# EAGLE design PowerBoard (EAGLE 5.07)
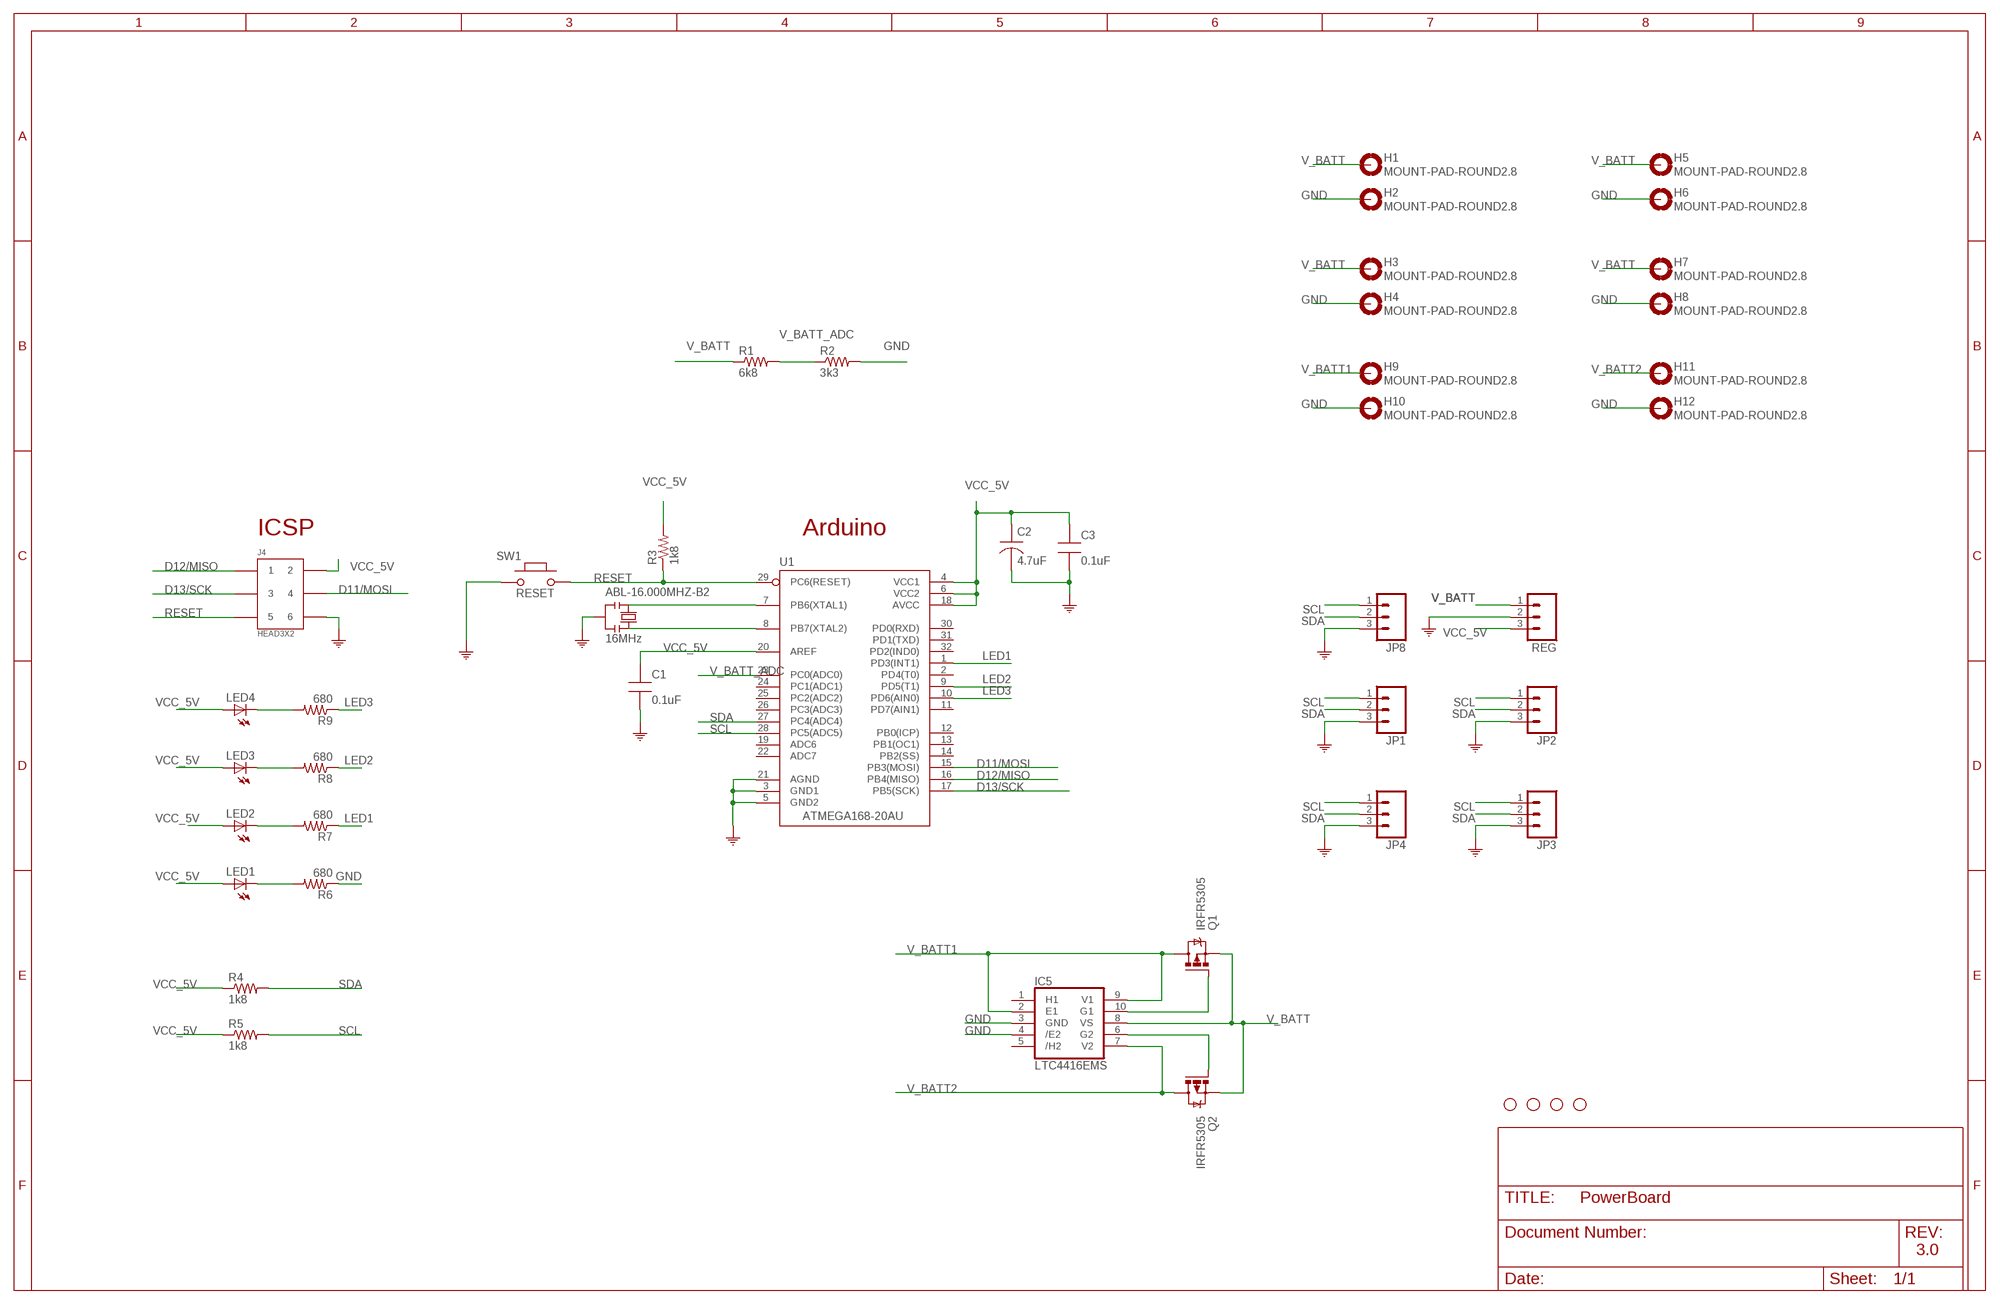
[diagram p0: schematic, sheet 1]

## Parts
ABL-16.000MHZ-B2  16MHz  RESONATORMU  [RESONATOR]
C1  0.1uF  CAP0805-NP  [CAP0805-NP]
C2  4.7uF  CAP-TANA-P  [TAN-A]
C3  0.1uF  CAP0805-NP  [CAP0805-NP]
H1  MOUNT-PAD-ROUND2.8  [2,8-PAD]
H2  MOUNT-PAD-ROUND2.8  [2,8-PAD]
H3  MOUNT-PAD-ROUND2.8  [2,8-PAD]
H4  MOUNT-PAD-ROUND2.8  [2,8-PAD]
H5  MOUNT-PAD-ROUND2.8  [2,8-PAD]
H6  MOUNT-PAD-ROUND2.8  [2,8-PAD]
H7  MOUNT-PAD-ROUND2.8  [2,8-PAD]
H8  MOUNT-PAD-ROUND2.8  [2,8-PAD]
H9  MOUNT-PAD-ROUND2.8  [2,8-PAD]
H10  MOUNT-PAD-ROUND2.8  [2,8-PAD]
H11  MOUNT-PAD-ROUND2.8  [2,8-PAD]
H12  MOUNT-PAD-ROUND2.8  [2,8-PAD]
IC5  LTC4416EMS  [MSOP10]
J4  HEAD3X2  [HEAD3X2]
JP1  M03PTH  [1X03]
JP2  M03PTH  [1X03]
JP3  M03PTH  [1X03]
JP4  M03PTH  [1X03]
JP8  M03PTH  [1X03]
JP12  STAND-OFF  [STAND-OFF]
JP13  STAND-OFF  [STAND-OFF]
JP14  STAND-OFF  [STAND-OFF]
JP15  STAND-OFF  [STAND-OFF]
LED1  LEDSMT1206  [1206]
LED2  LEDSMT1206  [1206]
LED3  LEDSMT1206  [1206]
LED4  LEDSMT1206  [1206]
Q1  IRFR5305  [D-PAK_TO252AA]
Q2  IRFR5305  [D-PAK_TO252AA]
R1  6k8  R-US_R0805  [R0805]
R2  3k3  R-US_R0805  [R0805]
R3  1k8  R-US_R0805  [R0805]
R4  1k8  R-US_R0805  [R0805]
R5  1k8  R-US_R0805  [R0805]
R6  680  R-US_R0805  [R0805]
R7  680  R-US_R0805  [R0805]
R8  680  R-US_R0805  [R0805]
R9  680  R-US_R0805  [R0805]
REG  M03PTH  [1X03]
SW1  RESET  PB157  [157SW]
U1  ATMEGA168-20AU  [QFP032]

## Nets
D11/MOSI: J4.4 U1.15(PB3(MOSI))
D12/MISO: J4.1 U1.16(PB4(MISO))
D13/SCK: J4.3 U1.17(PB5(SCK))
GND: ABL-16.000MHZ-B2.2 C1.2 C2.2 C3.2 H2.B2,8(MOUNT) H4.B2,8(MOUNT) H6.B2,8(MOUNT) H8.B2,8(MOUNT) H10.B2,8(MOUNT) H12.B2,8(MOUNT) IC5.3(GND) IC5.4(/E2) J4.6 JP1.3 JP2.3 JP3.3 JP4.3 JP8.3 R2.2 R6.1 REG.2 SW1.1 U1.3(GND1) U1.5(GND2) U1.21(AGND) ; supply symbol labelled COM
LED1: R7.1 U1.1(PD3(INT1))
LED2: R8.1 U1.9(PD5(T1))
LED3: R9.1 U1.10(PD6(AIN0))
N$1: ABL-16.000MHZ-B2.3 U1.8(PB7(XTAL2))
N$2: ABL-16.000MHZ-B2.1 U1.7(PB6(XTAL1))
N$3: LED1.C R6.2
N$4: LED2.C R7.2
N$5: LED3.C R8.2
N$6: LED4.C R9.2
N$7: IC5.10(G1) Q1.1(G)
N$8: IC5.6(G2) Q2.1(G)
RESET: J4.5 R3.1 SW1.2 U1.29(PC6(RESET))
SCL: JP1.1 JP2.1 JP3.1 JP4.1 JP8.1 R5.2 U1.28(PC5(ADC5))
SDA: JP1.2 JP2.2 JP3.2 JP4.2 JP8.2 R4.2 U1.27(PC4(ADC4))
V_BATT: H1.B2,8(MOUNT) H3.B2,8(MOUNT) H5.B2,8(MOUNT) H7.B2,8(MOUNT) IC5.8(VS) Q1.3(S) Q2.3(S) R1.1 REG.1
V_BATT1: H9.B2,8(MOUNT) IC5.2(E1) IC5.9(V1) Q1.4(D)
V_BATT2: H11.B2,8(MOUNT) IC5.7(V2) Q2.4(D)
V_BATT_ADC: R1.2 R2.1 U1.23(PC0(ADC0))
VCC_5V: C1.1 C2.1 C3.1 J4.2 LED1.A LED2.A LED3.A LED4.A R3.2 R4.1 R5.1 REG.3 U1.4(VCC1) U1.6(VCC2) U1.18(AVCC) U1.20(AREF)
Unconnected: IC5.1(H1) IC5.5(/H2) U1.2(PD4(T0)) U1.11(PD7(AIN1)) U1.12(PB0(ICP)) U1.13(PB1(OC1)) U1.14(PB2(SS)) U1.19(ADC6) U1.22(ADC7) U1.24(PC1(ADC1)) U1.25(PC2(ADC2)) U1.26(PC3(ADC3)) U1.30(PD0(RXD)) U1.31(PD1(TXD)) U1.32(PD2(IND0))

## Notes on the sheet
- ICSP | Arduino
- 3.0

## Library data of the parts
ABL-16.000MHZ-B2 = MySMD2:RESONATOR
C1 C3 = MySMD:CAP0805-NP
C2 = MySMD:CAP-TANA-P
H1-H12 = holes:MOUNT-PAD-ROUND: MOUNTING PAD, round
IC5 = linear-technology-3:LTC4416*: Low Loss Dual PowerPath Controllers
J4 = MyCON2:HEAD3X2
JP1-JP4 JP8 REG = SparkFun:M03: Header 3 Standard 3-pin 0.1" header. Use with straight break away headers (SKU : PRT-00116), right angle break away headers (PRT-00553), swiss pins (PRT-00743), machine pins (PRT-00117), and female headers (PRT-00115). Molex polarized connector foot print use with SKU : PRT-08232 with associated crimp pins and housings.
JP12-JP15 = SparkFun:STAND-OFF: Stand Off This is the mechanical footprint for a #4 phillips button head screw. Use the keepout ring to avoid running the screw head into surrounding components. SKU : PRT-00447
LED1-LED4 = led:LED: LED OSRAM: - CHIPLED LG R971, LG N971, LY N971, LG Q971, LY Q971, LO R971, LY R971 LH N974, LH R974 LS Q976, LO Q976, LY Q976 LO Q996 - Hyper CHIPLED LW Q18S LB Q993, LB Q99A, LB R99A - SideLED LS A670, LO A670, LY A670, LG A670, LP A670 LB A673, LV A673, LT A673, LW A673 LH A674 LY A675 LS A676, LA A676, LO A676, LY A676, LW A676 LS A679, LY A679, LG A679 - Hyper Micro SIDELED® LS Y876, LA Y876, LO Y876, LY Y876 LT Y87S - SmartLED LW L88C, LW L88S LB L89C, LB L89S, LG L890 LS L89K, LO L89K, LY L89K LS L896, LA L896, LO L896, LY L896 - TOPLED LS T670, LO T670, LY T670, LG T670, LP T670 LSG T670, LSP T670, LSY T670, LOP T670, LYG T670 LG T671, LOG T671, LSG T671 LB T673, LV T673, LT T673, LW T673 LH T674 LS T676, LA T676, LO T676, LY T676, LB T676, LH T676, LSB T676, LW T676 LB T67C, LV T67C, LT T67C, LS T67K, LO T67K, LY T67K, LW E67C LS E67B, LA E67B, LO E67B, LY E67B, LB E67C, LV E67C, LT E67C LW T67C LS T679, LY T679, LG T679 LS T770, LO T770, LY T770, LG T770, LP T770 LB T773, LV T773, LT T773, LW T773 LH T774 LS E675, LA E675, LY E675, LS T675 LS T776, LA T776, LO T776, LY T776, LB T776 LHGB T686 LT T68C, LB T68C - Hyper Mini TOPLED® LB M676 - Mini TOPLED Santana® LG M470 LS M47K, LO M47K, LY M47K Source: http://www.osram.convergy.de LUXEON: - LUMILED® LXK2-PW12-R00, LXK2-PW12-S00, LXK2-PW14-U00, LXK2-PW14-V00 LXK2-PM12-R00, LXK2-PM12-S00, LXK2-PM14-U00 LXK2-PE12-Q00, LXK2-PE12-R00, LXK2-PE12-S00, LXK2-PE14-T00, LXK2-PE14-U00 LXK2-PB12-K00, LXK2-PB12-L00, LXK2-PB12-M00, LXK2-PB14-N00, LXK2-PB14-P00, LXK2-PB14-Q00 LXK2-PR12-L00, LXK2-PR12-M00, LXK2-PR14-Q00, LXK2-PR14-R00 LXK2-PD12-Q00, LXK2-PD12-R00, LXK2-PD12-S00 LXK2-PH12-R00, LXK2-PH12-S00 LXK2-PL12-P00, LXK2-PL12-Q00, LXK2-PL12-R00 Source: www.luxeon.com KINGBRIGHT: KA-3528ASYC Source: www.kingbright.com
Q1 Q2 = transistor-power:IRF?5305: HEXFET Power MOSFET Source: http://www.irf.com/product-info/datasheets/data/irfr5305pbf.pdf
R1-R9 = resistor:R-US_: RESISTOR, American symbol
SW1 = MySMD:PB157
U1 = MySMD:ATMEGA168-20AU

## Board
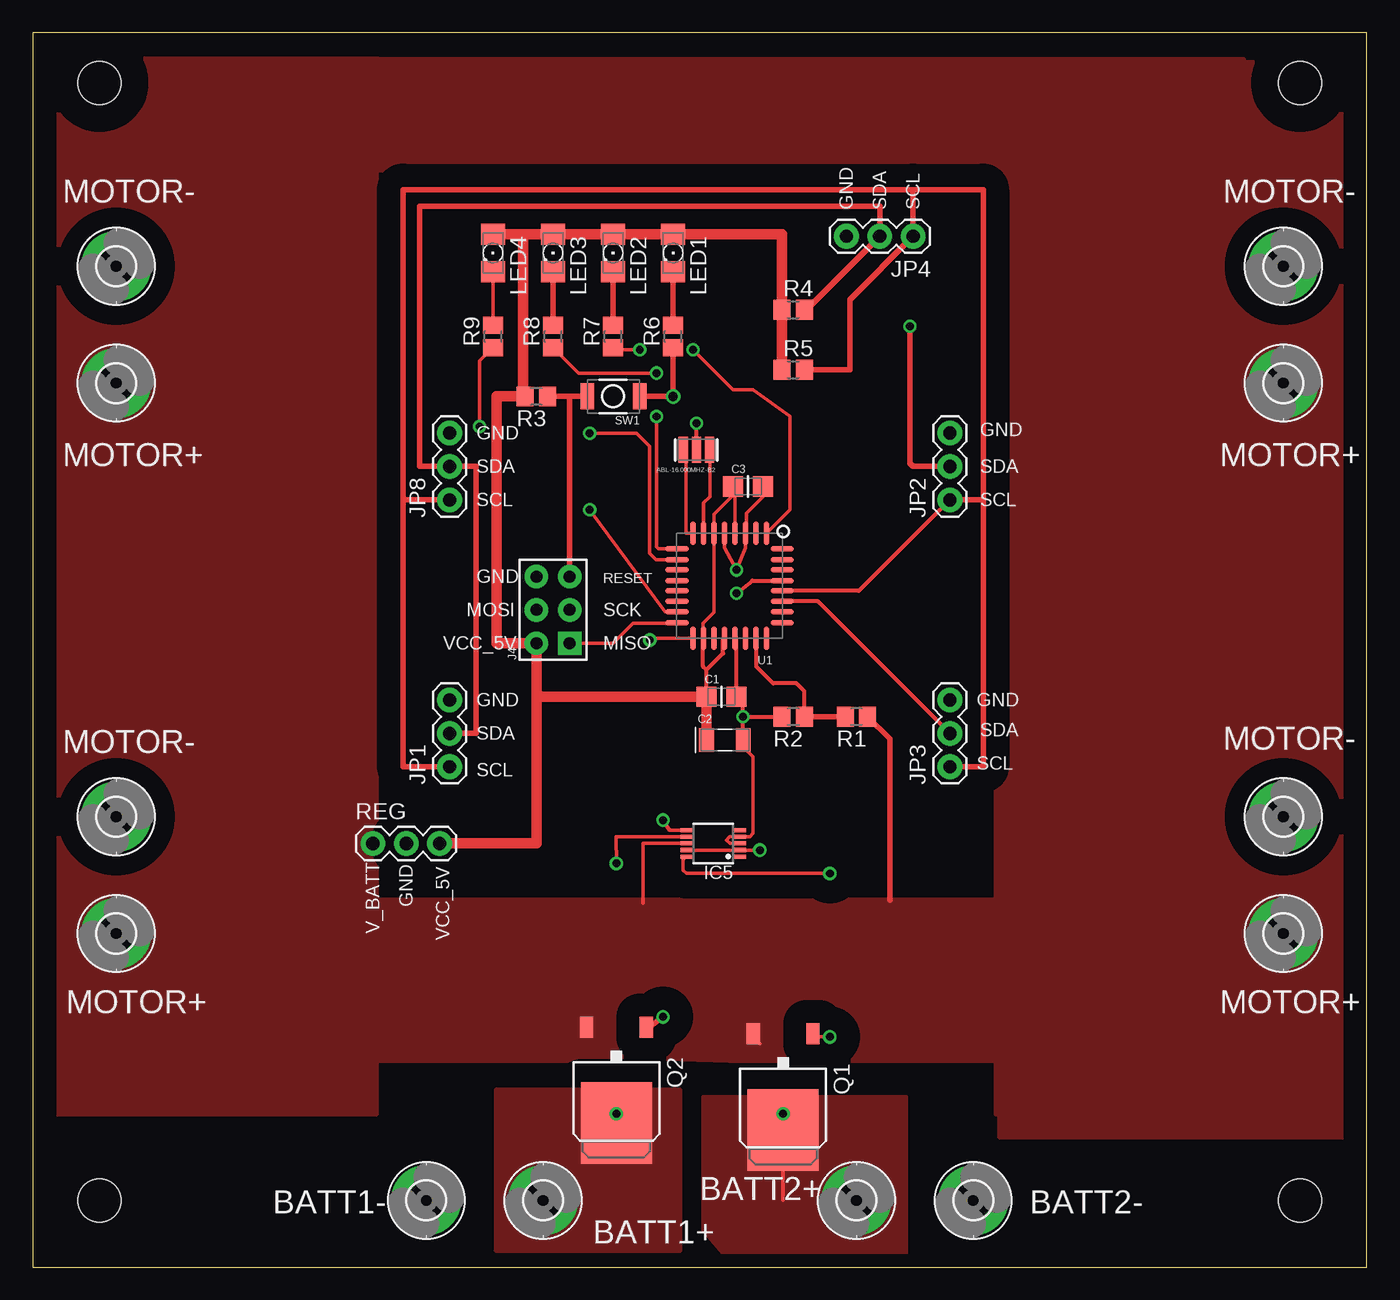
[diagram p1: board, top side]
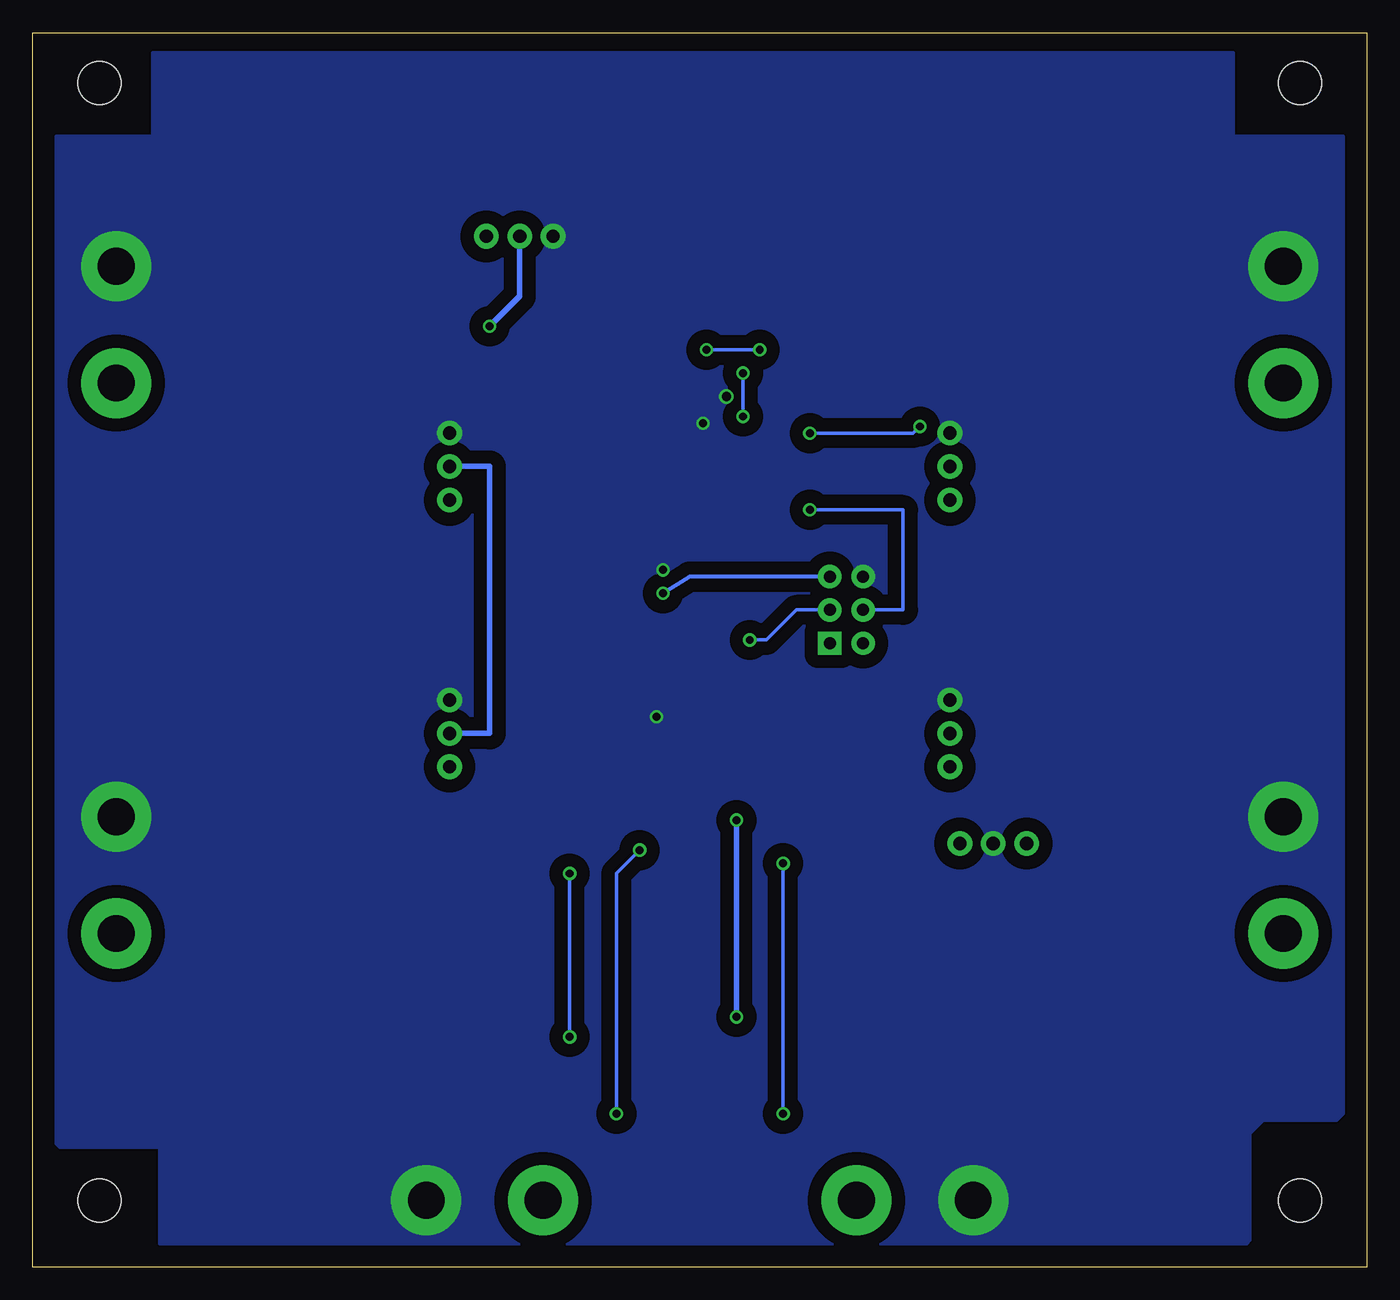
[diagram p2: board, bottom side, seen from below]

Size 101.6 x 93.98 mm. Coordinates in mm from the lower left corner, seen from the top.
Outline: 0,0 101.6,0 101.6,93.98 0,93.98 0,0
Copper layers (1*16): Top 0.035mm / dielectric 1.5mm / Bottom 0.035mm
Design rules "adv_2layer": minimum track width 6mil, minimum drill 15mil, track to track 6mil, track to pad 6mil, pad to pad 6mil, via to via 6mil, smd to smd 6mil, copper to edge 40mil, drill to drill 8mil, minimum pad ring 10mil, minimum via ring 8mil, stop-mask expansion 4mil, vias tented up to drill 0mil, thermal gap 10mil

### Footprints (pad centres in the part's own frame; a part is rotated, then mirrored left to right if it is on the bottom)
RESONATOR = smd 0.7 x 2: 1 -1,0; 2 0,0; 3 1,0
CAP0805-NP = smd 1.524 x 1.524: 1 0,0; 2 2.286,0
TAN-A = smd 1.118 x 1.778: 1 0,0; 2 2.794,0
2,8-PAD = drill 2.8 pad 5.334 round: B2,8 0,0
MSOP10 = smd 0.31 x 0.9: 1 -1,-2.05; 2 -0.5,-2.05; 3 0,-2.05; 4 0.5,-2.05; 5 1,-2.05; 6 1,2.05; 7 0.5,2.05; 8 0,2.05; 9 -0.5,2.05; 10 -1,2.05
HEAD3X2 = drill 0.914 pad 1.778 square: 1 0,0 | drill 0.914 pad 1.778 round: 2 0,2.54; 3 2.54,0; 4 2.54,2.54; 5 5.08,0; 6 5.08,2.54
1X03 = drill 1.016 pad 1.88 round: 1 0,0; 2 2.54,0; 3 5.08,0
STAND-OFF = hole 3.302: 0,0
1206 = smd 1.6 x 1.803: A -1.422,0; C 1.422,0
D-PAK_TO252AA = smd 1 x 1.6: 1 -2.28,-4.8; 3 2.28,-4.8 | smd 5.4 x 6.2: 4 0,2.5
R0805 = smd 1.3 x 1.5: 1 -0.85,0; 2 0.85,0
157SW = smd 1.016 x 1.981: 1 0,0; 2 4,0
QFP032 = smd 0.432 x 1.778: 1 0,0; 2 0.8,0; 3 1.599,0; 4 2.399,0; 5 3.199,0; 6 3.998,0; 7 4.798,0; 8 5.598,0; 17 5.588,8.001; 18 4.798,7.997; 19 3.998,7.997; 20 3.199,7.997; 21 2.399,7.997; 22 1.599,7.997; 23 0.799,7.997; 24 0,7.997 | smd 1.778 x 0.432: 9 6.807,1.194; 10 6.807,2.007; 11 6.807,2.794; 12 6.807,3.607; 13 6.807,4.394; 14 6.807,5.182; 15 6.807,5.994; 16 6.816,6.803; 25 -1.194,6.807; 26 -1.194,5.994; 27 -1.194,5.182; 28 -1.194,4.394; 29 -1.194,3.607; 30 -1.194,2.794; 31 -1.194,2.007; 32 -1.194,1.194

### Placement (x,y rotation side)
ABL-16.000MHZ-B2  50.55,62.23 180 top
C1  51.31,43.43 0 top
C2  51.31,40.13 0 top
C3  53.34,59.44 0 top
H1  6.35,25.4 0 top
H2  6.35,34.29 0 top
H3  6.35,67.31 0 top
H4  6.35,76.2 0 top
H5  95.25,25.4 0 top
H6  95.25,34.29 0 top
H7  95.25,67.31 0 top
H8  95.25,76.2 0 top
H9  62.74,5.08 0 top
H10  29.97,5.08 0 top
H11  38.86,5.08 0 top
H12  71.63,5.08 0 top
IC5  51.82,32.26 90 top
J4  40.89,47.5 90 top
JP1  31.75,38.1 90 top
JP2  69.85,58.42 90 top
JP3  69.85,38.1 90 top
JP4  67.06,78.49 180 top
JP8  31.75,58.42 90 top
JP12  96.52,90.17 0 top
JP13  5.08,90.17 0 top
JP14  96.52,5.08 0 top
JP15  5.08,5.08 0 top
LED1  48.77,77.22 270 top
LED2  44.2,77.22 270 top
LED3  39.62,77.22 270 top
LED4  35.05,77.22 270 top
Q1  57.15,12.95 180 top
Q2  44.45,13.46 180 top
R1  62.74,41.91 180 top
R2  57.91,41.91 180 top
R3  38.35,66.29 180 top
R4  57.91,72.9 0 top
R5  57.91,68.33 0 top
R6  48.77,70.87 90 top
R7  44.2,70.87 90 top
R8  39.62,70.87 90 top
R9  35.05,70.87 90 top
REG  25.91,32.26 0 top
SW1  46.23,66.29 180 top
U1  55.88,55.88 180 top

### Tracks (layer width: path | path; a pad name or v marks a point on that pad's centre or on a via)
D11/MOSI  (via drill 0.6)
  Top 0.254: U1.15 48.16,49.89 v42.42,57.66
  Bottom 0.254: v42.42,57.66 35.31,57.66 35.31,50.04 J4.4
D12/MISO
  Top 0.254: U1.16 49.01,49.02 45.72,49.02 44.2,47.5 J4.1
D13/SCK  (via drill 0.6)
  Top 0.254: U1.17 47.12,47.88 v46.99,47.75
  Bottom 0.254: J4.3 43.43,50.04 45.72,47.75 v46.99,47.75
GND  (via drill 0.6, 0.7)
  Top 0.254: U1.3 54.36,56.06 54.36,57.4 55.63,58.67 C3.2 | U1.3 54.36,55.95 | U1.3 54.28,54.79 v53.59,53.09 52.68,54.76 U1.5 | IC5.3 53.09,32.26 52.83,32.51 53.08,32.76 IC5.4 53.86,32.77 54.61,32.77 54.86,33.02 54.86,38.86 54.1,39.62 C2.2
  Top 0.305: U1.21 53.59,47.77 C1.2 54.1,42.93 v54.1,41.91 | v54.1,41.91 R2.2 | C2.2 v54.1,41.91 | ABL-16.000MHZ-B2.2 v50.55,64.26
  Top 0.406: SW1.1 v48.77,66.29 R6.1
  pour Bottom (isolate 1.016, no thermals): 1.78,86.11 10.16,86.11 10.16,92.46 92.46,92.46 92.46,86.11 99.82,86.11 99.82,9.4 99.57,9.14 91.95,9.14 91.95,1.78 9.14,1.78 8.89,2.03 8.89,10.16 7.87,11.18 2.29,11.18 1.78,11.68
LED1  (via drill 0.6)
  Top 0.254: R7.1 44.36,69.85 v46.23,69.85 | v50.29,69.85 53.34,66.8 54.86,66.8 57.66,64.77 57.66,57.66 U1.1
  Bottom 0.254: v50.29,69.85 v46.23,69.85
LED2  (via drill 0.6)
  Top 0.254: U1.9 47.68,54.69 47.5,54.86 v47.5,64.77 | R8.1 41.57,68.07 v47.5,68.07
  Bottom 0.254: v47.5,64.77 v47.5,68.07
LED3  (via drill 0.6)
  Top 0.254: U1.10 47.47,53.87 46.99,54.36 46.99,62.48 45.97,63.5 v42.42,63.5 | R9.1 34.04,69 v34.04,64.01
  Bottom 0.254: v42.42,63.5 34.54,63.5 v34.04,64.01
N$1
  Top 0.254: ABL-16.000MHZ-B2.3 49.77,62.23 49.77,55.88 U1.8
N$2
  Top 0.254: U1.7 51.08,58.19 51.56,58.67 51.56,62.21 ABL-16.000MHZ-B2.1
N$3
  Top 0.406: R6.2 LED1.C
N$4
  Top 0.406: R7.2 LED2.C
N$5
  Top 0.406: R8.2 LED3.C
N$6
  Top 0.254: R9.2 LED4.C
N$7  (via drill 0.6)
  Top 0.254: IC5.10 49.53,31.02 49.53,30.23 49.78,29.97 v60.71,29.97 | 59.46,17.53 v60.71,17.53
  Top 0.406: Q1.1 59.46,17.53
  Bottom 0.254: v60.71,17.53 v60.71,29.97
N$8  (via drill 0.6)
  Top 0.254: IC5.6 49.75,33.27 48.51,33.27 v48.01,34.04
  Top 0.406: Q2.1 47.01,17.78 47.01,18.31 v48.01,19.05
  Bottom 0.406: v48.01,19.05 v48.01,34.04
RESET  (via drill 0.61 pad 1.02)
  Top 0.305: U1.29 54.81,52.27 v53.59,51.31
  Top 0.406: 40.89,66.29 R3.1 | 40.89,66.29 SW1.2 | J4.5 40.89,66.29
  Bottom 0.305: v53.59,51.31 51.56,52.58 J4.5
SCL
  Top 0.305: U1.28 62.92,51.49 JP2.1
  Top 0.406: JP1.1 28.19,38.1 28.19,58.42 | 28.19,58.42 28.19,82.04 67.06,82.04 | 28.19,58.42 JP8.1 | 72.39,58.42 JP2.1 | 72.39,58.42 72.39,38.1 JP3.1 | 67.06,82.04 72.39,82.04 72.39,58.42 | 67.06,82.04 JP4.1 62.23,73.66 62.23,68.33 R5.2
SDA  (via drill 0.6)
  Top 0.305: U1.27 59.79,50.7 JP3.2
  Top 0.406: JP1.2 33.78,40.64 33.78,60.96 JP8.2 29.46,60.96 29.46,80.77 64.52,80.77 JP4.2 58.93,72.9 R4.2 | v66.8,71.63 66.8,61.21 67.06,60.96 JP2.2
  Bottom 0.254: JP8.2 32,60.71
  Bottom 0.406: JP3.2 66.8,40.64 66.8,60.96 JP2.2 69.85,61.21 | v66.8,71.63 64.52,73.91 JP4.2
V_BATT
  Top 0.254: 55.37,17.02 54.89,17.5 Q1.3 | IC5.8 46.48,32.26 46.48,27.69
  Top 0.406: R1.1 65.28,40.22 65.28,27.94
  pour Top (isolate 1.778, no thermals): 1.78,92.2 26.16,92.2 26.16,11.68 1.78,11.68
  pour Top (isolate 1.778, no thermals): 21.08,27.94 44.45,27.94 44.45,15.75 21.08,15.75
  pour Top (isolate 1.778, no thermals): 100.58,9.91 73.66,9.91 73.66,11.68 73.41,11.68 73.41,83.57 8.89,83.57 8.89,91.95 92.2,91.95 92.2,91.69 100.58,91.69
  pour Top (isolate 1.778, no thermals): 44.2,16 53.09,15.75 56.39,15.75 73.66,15.75 73.66,27.94 44.2,27.94
V_BATT1  (via drill 0.6, 0.61 pad 1.02)
  Top 0.254: 57.15,5.08 Q1.4 | IC5.9 IC5.2 v55.36,31.76 v55.37,31.75
  Bottom 0.254: v55.37,31.75 57.15,29.97 v57.15,11.68
  pour Top (isolate 1.016, no thermals): 51.05,12.95 66.55,12.95 66.55,1.02 52.58,1.02 51.05,2.79
V_BATT2  (via drill 0.6, 0.61 pad 1.02)
  Top 0.254: v44.45,30.73 44.44,32.76 IC5.7
  Bottom 0.254: v44.45,11.68 v44.45,30.73
  pour Top (isolate 1.016, no thermals): 35.31,13.46 49.28,13.46 49.28,1.27 35.31,1.27
V_BATT_ADC
  Top 0.305: U1.23 55.12,47.85 55.12,45.72 56.39,44.45 58.17,44.45 58.76,43.85 R2.1
  Top 0.406: R2.1 R1.2
VCC_5V
  Top 0.254: U1.18 51.05,47.91 51.05,49.02 51.88,49.85 U1.6 51.88,57.33 53.48,58.93 | 37.34,66.29 R3.2 | 53.48,58.93 U1.4 | 53.48,58.93 53.48,59.3 C3.1
  Top 0.305: C1.1 51.31,45.47 | 51.31,45.47 51.05,45.72 51.05,47.85 U1.18 | U1.20 52.68,47.85 52.58,47.75 52.58,46.74 51.31,45.47
  Top 0.813: REG.3 38.35,32.26 38.35,43.69 | 38.35,43.69 J4.2 35.31,47.5 35.31,66.29 37.34,66.29 37.34,78.64 | 37.34,78.64 LED4.A | 37.34,78.64 LED3.A LED2.A LED1.A 57.06,78.64 R4.1 R5.1 | C2.1 C1.1 38.61,43.43 38.35,43.69

### Text on the board
_tsilk: MOTOR- | GND | SDA | SCL | MOTOR- | GND | GND | MOTOR+ | MOTOR+ | SDA | SDA | SCL | SCL | GND | RESET | MOSI | SCK | VCC_5V | MISO | GND | GND | SDA | SDA | MOTOR- | MOTOR- | SCL | SCL | GND | V_BATT | VCC_5V | MOTOR+ | MOTOR+ | BATT2+ | BATT1- | BATT2- | BATT1+